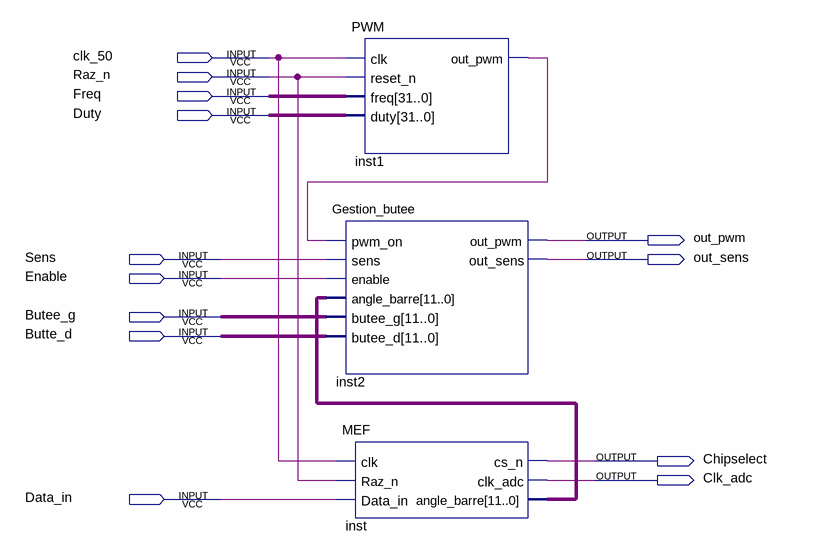
[diagram p0: schematic sheet]
// Quartus schematic Convertisseur.bdf as structural Verilog: 3 symbols, 13 pins
module Convertisseur (
  input  clk_50,
  input  Raz_n,
  input  Freq,
  input  Duty,
  input  Sens,
  input  Enable,
  input  Butee_g,
  input  Butte_d,
  input  Data_in,
  output out_pwm,
  output out_sens,
  output Chipselect,
  output Clk_adc
);

  wire inst1_out_pwm;
  wire [11:0] inst_angle_barre, undriven, undriven_2;
  wire [31:0] undriven_3, undriven_4;

  PWM inst1 (.clk(clk_50), .reset_n(Raz_n), .freq(undriven_4), .duty(undriven_3), .out_pwm(inst1_out_pwm));
  Gestion_butee inst2 (
    .pwm_on(inst1_out_pwm), .sens(Sens), .enable(Enable), .angle_barre(inst_angle_barre), .butee_g(undriven),
    .butee_d(undriven_2), .out_pwm(out_pwm), .out_sens(out_sens));
  MEF inst (
    .clk(clk_50), .Raz_n(Raz_n), .Data_in(Data_in), .cs_n(Chipselect), .clk_adc(Clk_adc),
    .angle_barre(inst_angle_barre));
endmodule
